# EAGLE design oresat-minusz-end-card (EAGLE 9.2.2)
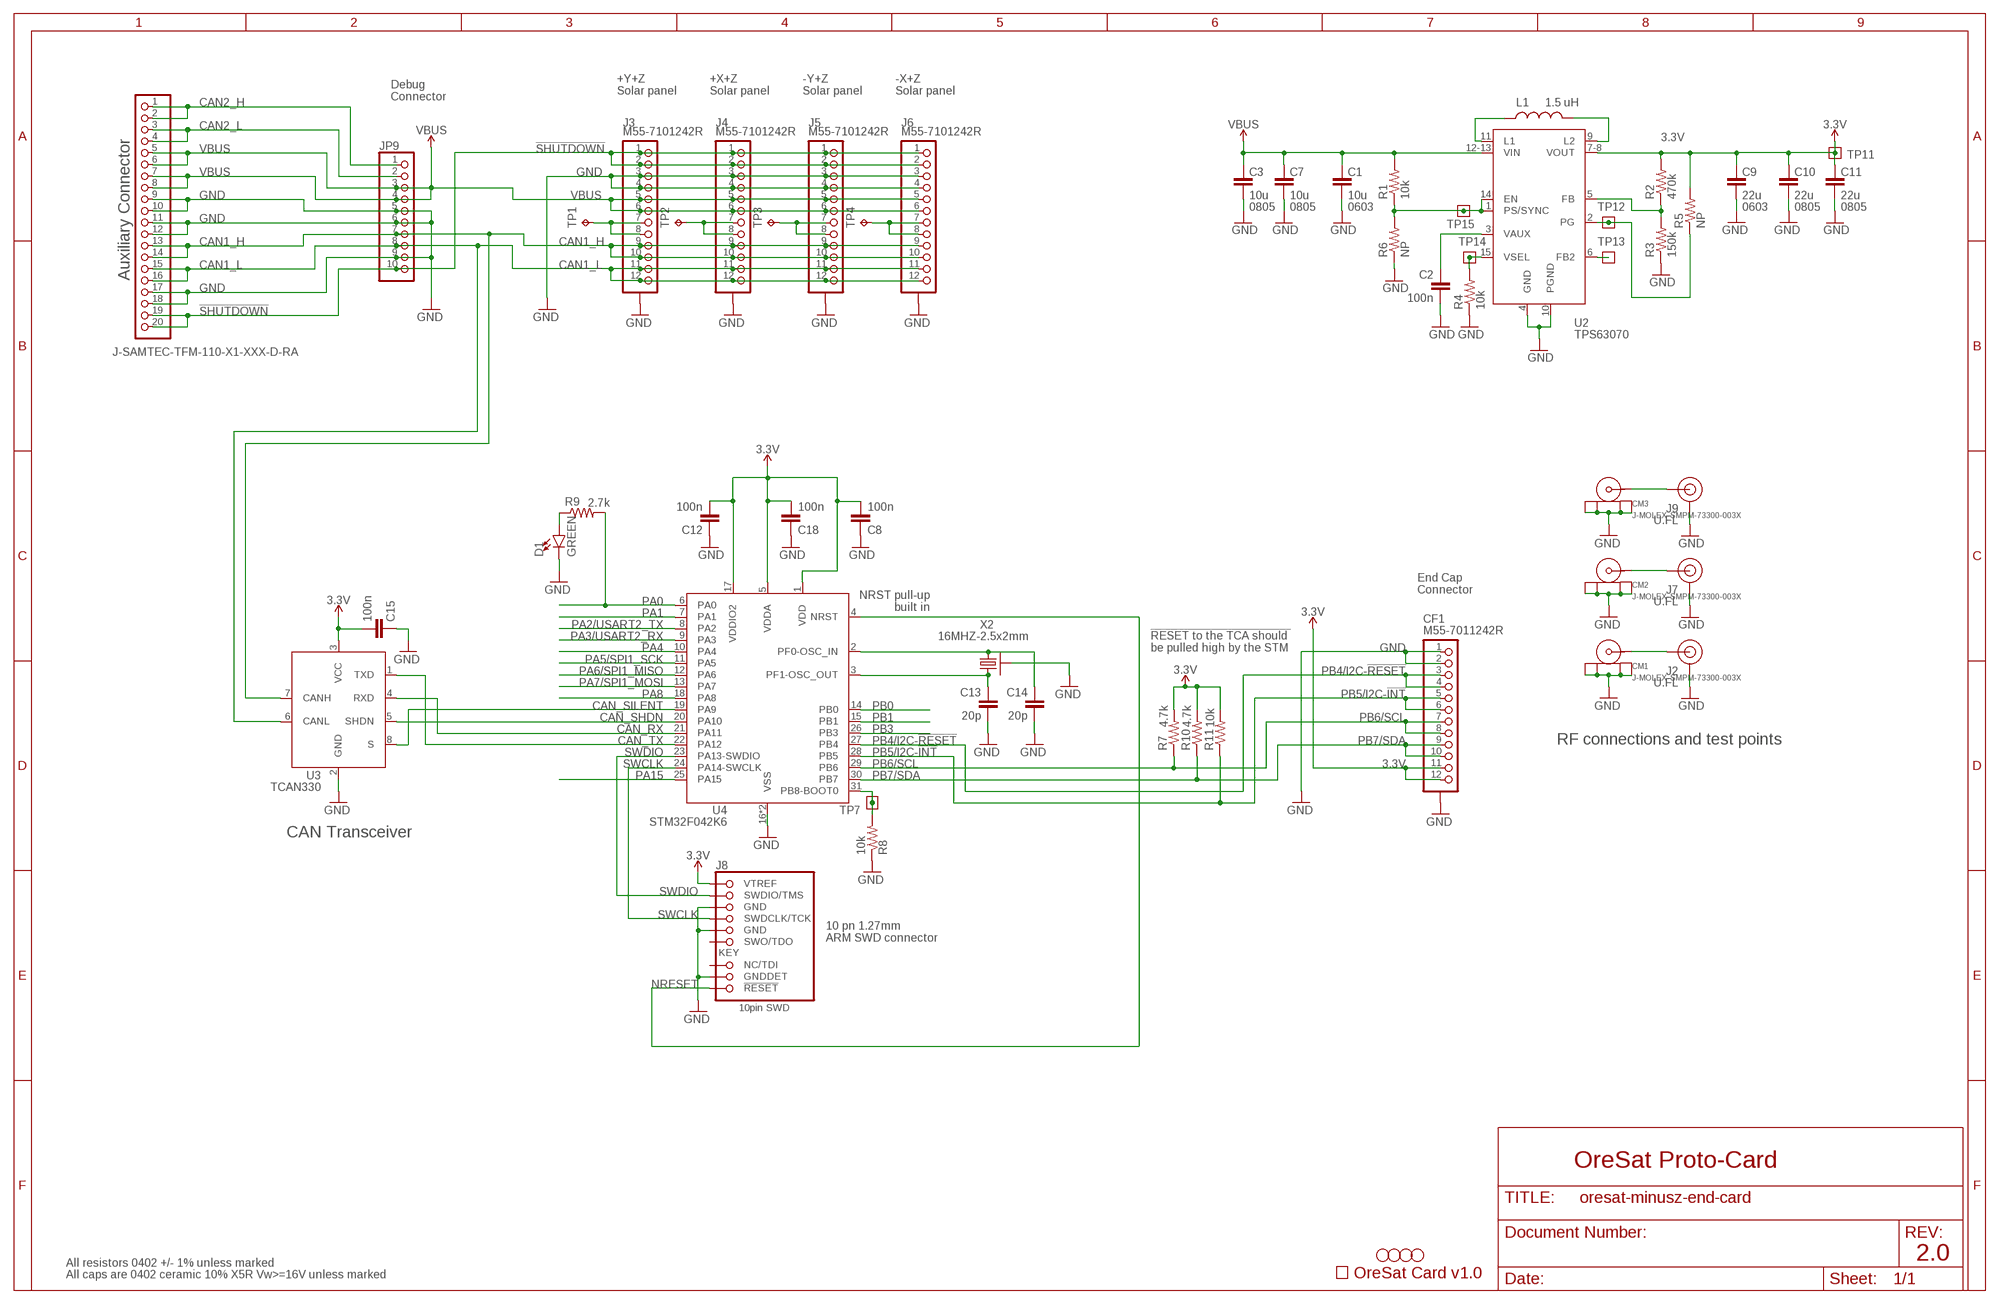
[diagram p0: schematic, sheet 1]

## Parts
C1  10u  C-EU0603-B-NOSILK  [.0603-B-NOSILK]
C2  100n  C-EU0402-B-NOSILK  [.0402-B-NOSILK]
C3  10u  C-EU0805-B-NOSILK  [.0805-B-NOSILK]
C7  10u  C-EU0805-B-NOSILK  [.0805-B-NOSILK]
C8  100n  C-EU0402-B-NOSILK  [.0402-B-NOSILK]
C9  22u  C-EU0603-B-NOSILK  [.0603-B-NOSILK]
C10  22u  C-EU0805-B-NOSILK  [.0805-B-NOSILK]
C11  22u  C-EU0805-B-NOSILK  [.0805-B-NOSILK]
C12  100n  C-EU0402-B-NOSILK  [.0402-B-NOSILK]
C13  20p  C-EU0402-B-NOSILK  [.0402-B-NOSILK]
C14  20p  C-EU0402-B-NOSILK  [.0402-B-NOSILK]
C15  100n  C-EU0402-B-NOSILK  [.0402-B-NOSILK]
C18  100n  C-EU0402-B-NOSILK  [.0402-B-NOSILK]
CARD  ORESAT-CARD-V0.5  [ORESAT-CARD-V1.0]
CF1  M55-7011242R  J-HARWIN-M55-6021242R  [HARWIN-M55-6021242R]
CM1  J-MOLEX-SMPM-73300-003X  [J-MOLEX-SMPM-073300-003X]
CM2  J-MOLEX-SMPM-73300-003X  [J-MOLEX-SMPM-073300-003X]
CM3  J-MOLEX-SMPM-73300-003X  [J-MOLEX-SMPM-073300-003X]
D1  GREEN  LED-GREEN0603  [LED-0603]
H1  STAND-OFFTIGHT  [STAND-OFF-TIGHT]
H2  STAND-OFFTIGHT  [STAND-OFF-TIGHT]
H3  STAND-OFFTIGHT  [STAND-OFF-TIGHT]
H4  STAND-OFFTIGHT  [STAND-OFF-TIGHT]
J1  J-SAMTEC-TFM-110-X1-XXX-D-RA  [J-SAMTEC-TFM-110-X1-XXX-D-RA]
J2  U.FL  U.FL2PIN  [U.FL]
J3  M55-7101242R  [M55-7101242R]
J4  M55-7101242R  [M55-7101242R]
J5  M55-7101242R  [M55-7101242R]
J6  M55-7101242R  [M55-7101242R]
J7  U.FL  U.FL2PIN  [U.FL]
J8  FTSH-105-XX-X-DV-K  [CON10_2X5_DUK_FTSH]
J9  U.FL  U.FL2PIN  [U.FL]
JP9  PINHD-1X10  [1X10]
L1  1.5 uH  L-COILCRAFT-XFL4020  [L-COILCRAFT-XFL4020]
R1  10k  R-US_0402-B-NOSILK  [.0402-B-NOSILK]
R2  470k  R-US_0402-B-NOSILK  [.0402-B-NOSILK]
R3  150k  R-US_0402-B-NOSILK  [.0402-B-NOSILK]
R4  10k  R-US_0402-B-NOSILK  [.0402-B-NOSILK]
R5  NP  R-US_0402-B-NOSILK  [.0402-B-NOSILK]
R6  NP  R-US_0402-B-NOSILK  [.0402-B-NOSILK]
R7  4.7k  R-US_0402-B-NOSILK  [.0402-B-NOSILK]
R8  10k  R-US_0402-B-NOSILK  [.0402-B-NOSILK]
R9  2.7k  R-US_0402-B-NOSILK  [.0402-B-NOSILK]
R10  4.7k  R-US_0402-B-NOSILK  [.0402-B-NOSILK]
R11  10k  R-US_0402-B-NOSILK  [.0402-B-NOSILK]
TP1  TPPAD1-13  [P1-13]
TP2  TPPAD1-13  [P1-13]
TP3  TPPAD1-13  [P1-13]
TP4  TPPAD1-13  [P1-13]
TP7  TEST-POINT  [2MM-TEST-POINT]
TP11  TEST-POINT  [2MM-TEST-POINT]
TP12  TEST-POINT  [2MM-TEST-POINT]
TP13  TEST-POINT  [2MM-TEST-POINT]
TP14  TEST-POINT  [2MM-TEST-POINT]
TP15  TEST-POINT  [2MM-TEST-POINT]
U2  TPS63070  TPS63070X  [TPS63070X]
U3  TCAN330  [SOT23-8_TI-DCN]
U4  STM32F042K6  [QFP32-7X7]
X2  16MHZ-2.5x2mm  CRYSTAL-WITH-GND  [CRYSTAL_2.5X2]

## Nets
3.3V: C8.2 C9.1 C10.1 C11.1 C12.2 C15.2 C18.2 CF1.11 CF1.12 J8.1(VTREF) R2.2 R5.2 R7.2 R10.2 R11.2 TP11.1 U2.7-8(VOUT) U3.3(VCC) U4.1(VDD) U4.5(VDDA) U4.17(VDDIO2)
!SHUTDOWN: J1.19 J1.20 J3.1 J3.2 J4.1 J4.2 J5.1 J5.2 J6.1 J6.2 JP9.10
BOOT1: R8.2 TP7.1 U4.31(PB8-BOOT0)
CAN1_H: J1.13 J1.14 J3.9 J3.10 J4.9 J4.10 J5.9 J5.10 J6.9 J6.10 JP9.7 U3.7(CANH)
CAN1_L: J1.15 J1.16 J3.11 J3.12 J4.11 J4.12 J5.11 J5.12 J6.11 J6.12 JP9.8 U3.6(CANL)
CAN2_H: J1.1 J1.2 JP9.1
CAN2_L: J1.3 J1.4 JP9.2
CAN_RX: U3.4(RXD) U4.21(PA11)
CAN_SHDN: U3.5(SHDN) U4.20(PA10)
CAN_SILENT: U3.8(S) U4.19(PA9)
CAN_TX: U3.1(TXD) U4.22(PA12)
CRYSTALIN1: C14.1 U4.2(PF0-OSC_IN) X2.1
CRYSTALOUT1: C13.1 U4.3(PF1-OSC_OUT) X2.3
GND: C1.2 C2.2 C3.2 C7.2 C8.1 C9.2 C10.2 C11.2 C12.1 C13.2 C14.2 C15.1 C18.1 CF1.1 CF1.2 CF1.P$1(SHIELDS) CF1.P$2(SHIELDS) CF1.P$3(SHIELDS) CF1.P$4(SHIELDS) CM1.P$1(SHIELD3) CM1.P$2(SHIELD2) CM1.P$3(SHIELD1) CM1.P$4(SHIELD) CM2.P$1(SHIELD3) CM2.P$2(SHIELD2) CM2.P$3(SHIELD1) CM2.P$4(SHIELD) CM3.P$1(SHIELD3) CM3.P$2(SHIELD2) CM3.P$3(SHIELD1) CM3.P$4(SHIELD) D1.C J1.9 J1.10 J1.11 J1.12 J1.17 J1.18 J2.1(GND) J2.2(GND) J3.3 J3.4 J3.P$1(SHIELD) J3.P$2(SHIELD) J3.P$3(SHIELD) J3.P$4(SHIELD) J4.3 J4.4 J4.P$1(SHIELD) J4.P$2(SHIELD) J4.P$3(SHIELD) J4.P$4(SHIELD) J5.3 J5.4 J5.P$1(SHIELD) J5.P$2(SHIELD) J5.P$3(SHIELD) J5.P$4(SHIELD) J6.3 J6.4 J6.P$1(SHIELD) J6.P$2(SHIELD) J6.P$3(SHIELD) J6.P$4(SHIELD) J7.1(GND) J7.2(GND) J8.3(GND) J8.5(GND) J8.9(GNDDET) J9.1(GND) J9.2(GND) JP9.5 JP9.6 JP9.9 R3.1 R4.1 R6.1 R8.1 U2.4(GND) U2.10(PGND) U3.2(GND) U4.16(VSS) U4.32(VSS) X2.2(SHIELD) X2.4(SHIELD)
N$1: J4.7 J4.8 TP2.TP
N$2: J3.7 J3.8 TP1.TP
N$4: J5.7 J5.8 TP3.TP
N$5: J6.7 J6.8 TP4.TP
N$7: D1.A R9.1
NRESET: J8.10(!RESET) U4.4(NRST)
PA0: R9.2 U4.6(PA0)
PA1: U4.7(PA1)
PA2/USART2_TX: U4.8(PA2)
PA3/USART2_RX: U4.9(PA3)
PA4: U4.10(PA4)
PA5/SPI1_SCK: U4.11(PA5)
PA6/SPI1_MISO: U4.12(PA6)
PA7/SPI1_MOSI: U4.13(PA7)
PA8: U4.18(PA8)
PA15: U4.25(PA15)
PB0: U4.14(PB0)
PB1: U4.15(PB1)
PB3: U4.26(PB3)
PB4/I2C-!RESET: CF1.3 CF1.4 U4.27(PB4)
PB5/I2C-!INT: CF1.5 CF1.6 R11.1 U4.28(PB5)
PB6/SCL: CF1.7 CF1.8 R7.1 U4.29(PB6)
PB7/SDA: CF1.9 CF1.10 R10.1 U4.30(PB7)
RF1: CM1.RF(CENTER) J2.FEED(SIGNAL)
RF2: CM2.RF(CENTER) J7.FEED(SIGNAL)
RF3: CM3.RF(CENTER) J9.FEED(SIGNAL)
SWCLK: J8.4(SWDCLK/TCK) U4.24(PA14-SWCLK)
SWDIO: J8.2(SWDIO/TMS) U4.23(PA13-SWDIO)
TPS-EN2: R1.1 R6.2 TP15.1 U2.1(PS/SYNC) U2.14(EN)
TPS-FB2: R2.1 R3.2 U2.5(FB)
TPS-FB4: TP13.1 U2.6(FB2)
TPS-L1: L1.1 U2.11(L1)
TPS-L2: L1.2 U2.9(L2)
TPS-PG2: R5.1 TP12.1 U2.2(PG)
TPS-VAUX2: C2.1 U2.3(VAUX)
TPS-VSEL2: R4.2 TP14.1 U2.15(VSEL)
VBUS: C1.1 C3.1 C7.1 J1.5 J1.6 J1.7 J1.8 J3.5 J3.6 J4.5 J4.6 J5.5 J5.6 J6.5 J6.6 JP9.3 JP9.4 R1.2 U2.12-13(VIN)
Unconnected: J8.6(SWO/TDO) J8.8(NC/TDI)

## Notes on the sheet
- +Y+Z
  Solar panel
- +X+Z
  Solar panel
- -Y+Z
  Solar panel
- -X+Z
  Solar panel
- Debug
  Connector
- 0805 | 0805 | 0603 | 0603 | 0805 | 0805
- Auxiliary Connector
- End Cap
  Connector
- NRST pull-up
  built in
- !RESET to the TCA should 
  be pulled high by the STM
- RF connections and test points
- CAN Transceiver
- 10 pn 1.27mm 
  ARM SWD connector
- OreSat Proto-Card
- 2.0
- All resistors 0402 +/- 1% unless marked
- All caps are 0402 ceramic 10% X5R Vw>=16V unless marked

## Library data of the parts
C1 C9 = oresat-rcl:C-EU: CAPACITOR, European symbol; DIS: Digi-Key; DPN: 1276-1001-1-ND; MFR: Samsung; MPN: CL05B104KO5NNNC
C2 C8 C12 C15 C18 = rcl_custom:C-EU: CAPACITOR, European symbol; DIS: Digi-Key; DPN: 1276-1001-1-ND; MFR: Samsung; MPN: CL05B104KO5NNNC
C3 C7 C10 C11 = oresat-rcl:C-EU: CAPACITOR, European symbol
C13 C14 = rcl_custom:C-EU: CAPACITOR, European symbol; DIS: Digi-Key; DPN: 1276-6601-1-ND; MFR: Samsung; MPN: CL05C200JB51PNC
CARD = oresat-card:ORESAT-CARD-V0.5
CF1 = J-Harwin-M55-6021242R:J-HARWIN-M55-6021242R
CM1-CM3 = J-Molex-SMPM-73300-003X:J-MOLEX-SMPM-73300-003X
D1 = SparkFun-LED:LED-GREEN: Green SMD LED Used in manufacturing of various products at SparkFun Packages: 0603 - SMD 0603 package [Product Link] <http://www.futureelectronics.com/en/technologies/semiconductors/optoelectronics/leds/Pages/9894312-LTST-C190GKT.aspx?CrossPart=HSMG-C190&IM=0> LilyPad 1206 - SMD1206 LilyPad package [Product Link] <http://www.futureelectronics.com/en/Technologies/Product.aspx?ProductID=IN150NGHARVATEKCORPORATION2049943&IM=0> 1206 - SMD1206 package [Product Link] <http://www.futureelectronics.com/en/technologies/semiconductors/optoelectronics/leds/Pages/8315665-LTST-C150KGKT.aspx?IM=0> 1206 Bottom Mount -SMD 1206 Bottom Mount [Product Link] <http://www.digikey.com/product-detail/en/lite-on-inc/LTST-C230KGKT/160-1456-1-ND/386854> SparkFun Products: Pro Mini 328 -5V <https://www.sparkfun.com/products/821> RedBoard <https://www.sparkfun.com/products/12757> MP3 Trigger <https://www.sparkfun.com/products/13720> Makey Makey <https://www.sparkfun.com/products/11076>; PROD_ID: DIO-00821
H1-H4 = SparkFun-Hardware:STAND-OFF: Stand Off Drill holes for mechanically mounting via screws, standoffs, etc. Note: Use the keepout ring to avoid running the screw head into surrounding components. Variant Overviews STAND-OFF - Mechanical footprint for a #4 phillips button head screw. STAND-OFF-TIGHT - Mechanical footprint for a #4 phillips button head screw, Example SparkFun Products Screw - Phillips Head (1/4", 4-40, 10 pack) <https://www.sparkfun.com/products/10453> (PRT-10453) Screw - Phillips Head (1/2", 4-40, 10 pack) <https://www.sparkfun.com/products/10452> (PRT-10452) Screw - Phillips Head (3/4", 4-40, 10 pack) <https://www.sparkfun.com/products/10451> (PRT-10451) Screw - Phillips Head (1", 4-40, 10 pack) <https://www.sparkfun.com/products/10450> (PRT-10450)
J1 = J-Samtec-TFM-110-X1-XXX-D-RA:J-SAMTEC-TFM-110-X1-XXX-D-RA; DIS: Digi-Key; DPN: SAM10113-ND; MFR: Samtec; MPN: TFM-110-01-L-D-RA
J2 J7 J9 = SparkFun-Connectors:U.FL2PIN: SMD Antenna Connector - U.FL 2mm height, 3.0mm x 3.0mm receptacle size. SparkFun Products: SparkFun WiFi Shield - ESP8266 <https://www.sparkfun.com/products/13287> SparkFun ESP8266 Thing <https://www.sparkfun.com/products/13231> SparkFun MiniGen - Pro Mini Signal Generator Shield <https://www.sparkfun.com/products/11420>; PROD_ID: CONN-09193; SF_ID: WRL-09144
J3-J6 = J-Harwin-M55-7101242:M55-7101242R: Harwin M55-7101242R A 12 pin 1.27 mm male SMT connector with plastic alignment pins. Note: alignment pin hole diameters are 0.05 mm smaller than recommended in order to tighten up connector location; this requires hand placement of this package.
J8 = J-Samtec-FTSH-105-XXX-DV-K-ARM-SWD:FTSH-105-XX-X-DV-K; DIS: Digi-Key; DPN: 1175-1627-ND; MFR: CNC Tech; MPN: 3220-10-0100-00
JP9 = pinhead:PINHD-1X10: PIN HEADER
L1 = L-Coilcraft-XFL4020:L-COILCRAFT-XFL4020; DIS: Mouser; DPN: 994-XFL4020-152MEB; MFR: Coilcraft; MPN: XFL4020-152ME
R1-R11 = rcl_custom:R-US_: RESISTOR, American symbol; DIS: Digi-Key; DPN: 1276-4275-1-ND; MFR: Samsung; MPN: RC1005F6653CS
TP1-TP4 = testpad:TP: Test pad
TP7 TP11-TP15 = Tova:TEST-POINT
U2 = ic-pwr-tps63070x:TPS63070X: TPS63070 2-V to 16-V Buck-Boost Converter With 3.6-A Switch Current; DIS: Digi-Key; DPN: 296-44874-1-ND; MFR: TI; MPN: TPS63070
U3 = TCAN330:TCAN330; DIS: Digi-Key; DPN: 296-44211-1-ND; MFR: Texas Instruments; MPN: TCAN330GDCNT
U4 = STM32F042K:STM32F042K6; DIS: Digi-Key; DPN: STM32F042K6T7-ND; MFR: STMicroelectronics; MPN: STM32F042K6T7
X2 = low-gain-radio:CRYSTAL-WITH-GND; DIS: Digi-Key; DPN: XC2181CT-ND; MFR: ECS Inc.; MPN: ECS-160-10-36Q-ES-TR

## Board
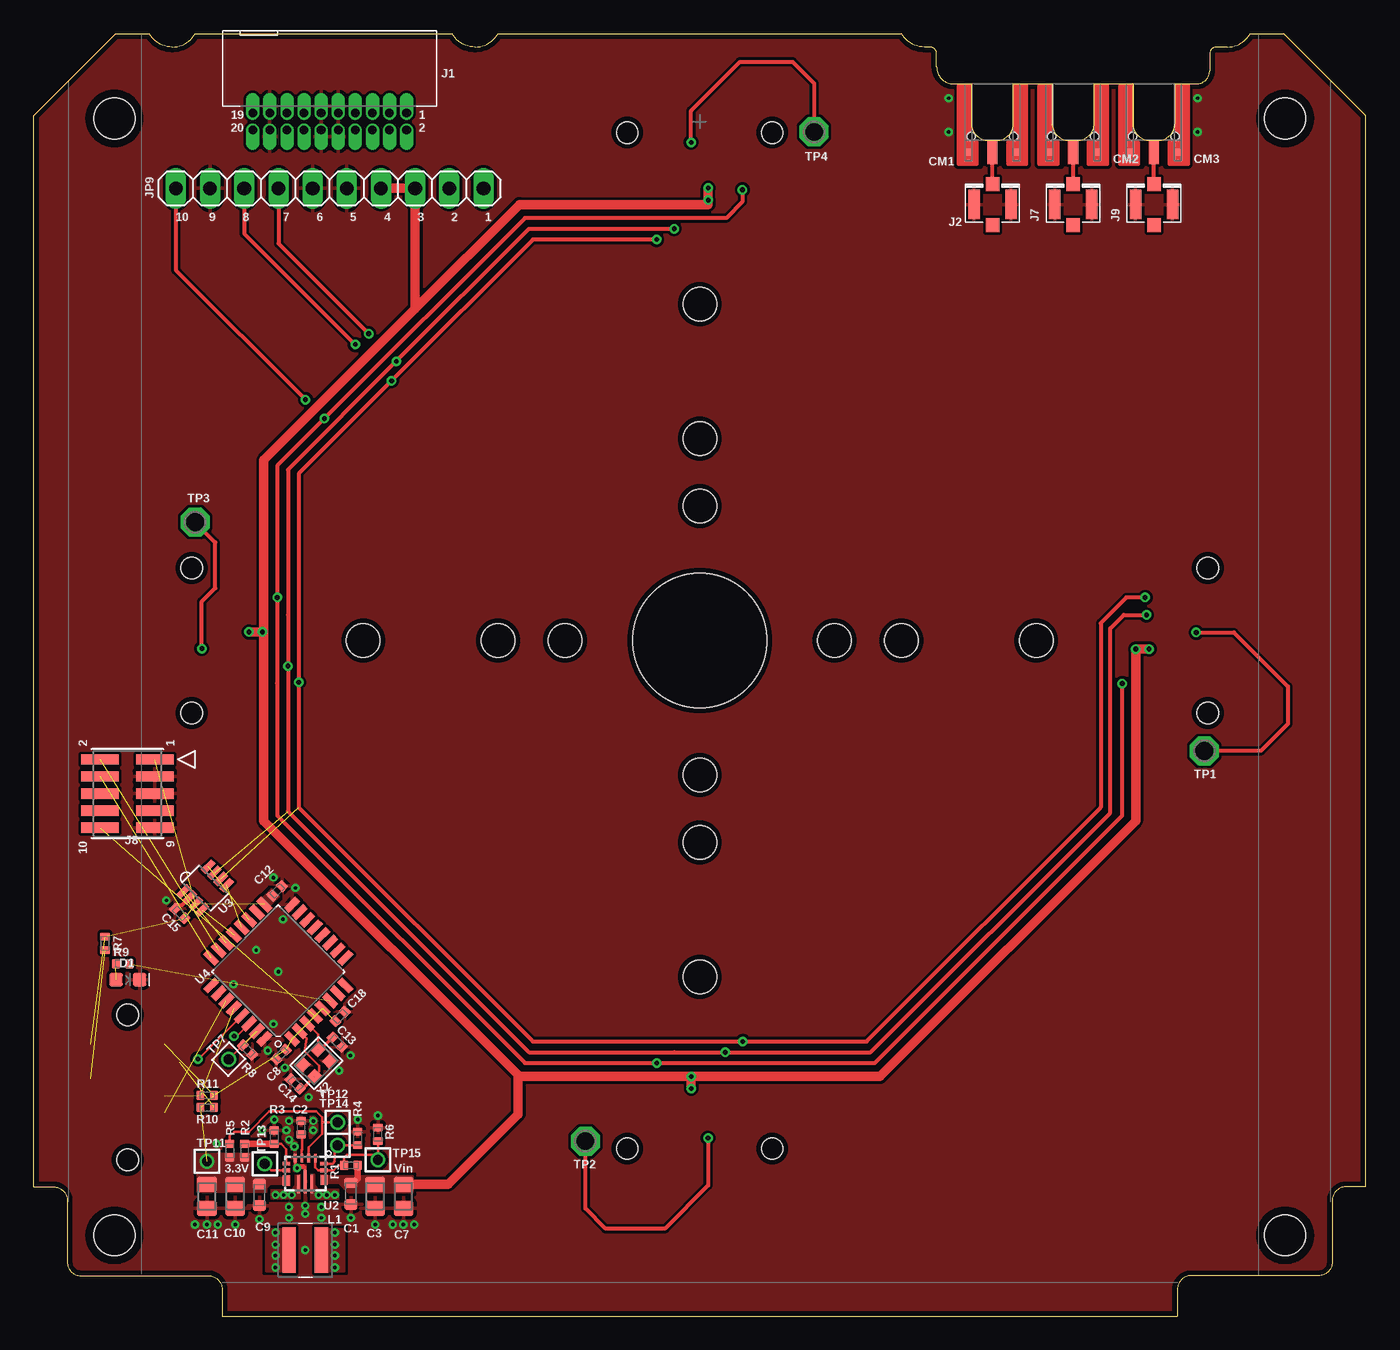
[diagram p1: board, top side]
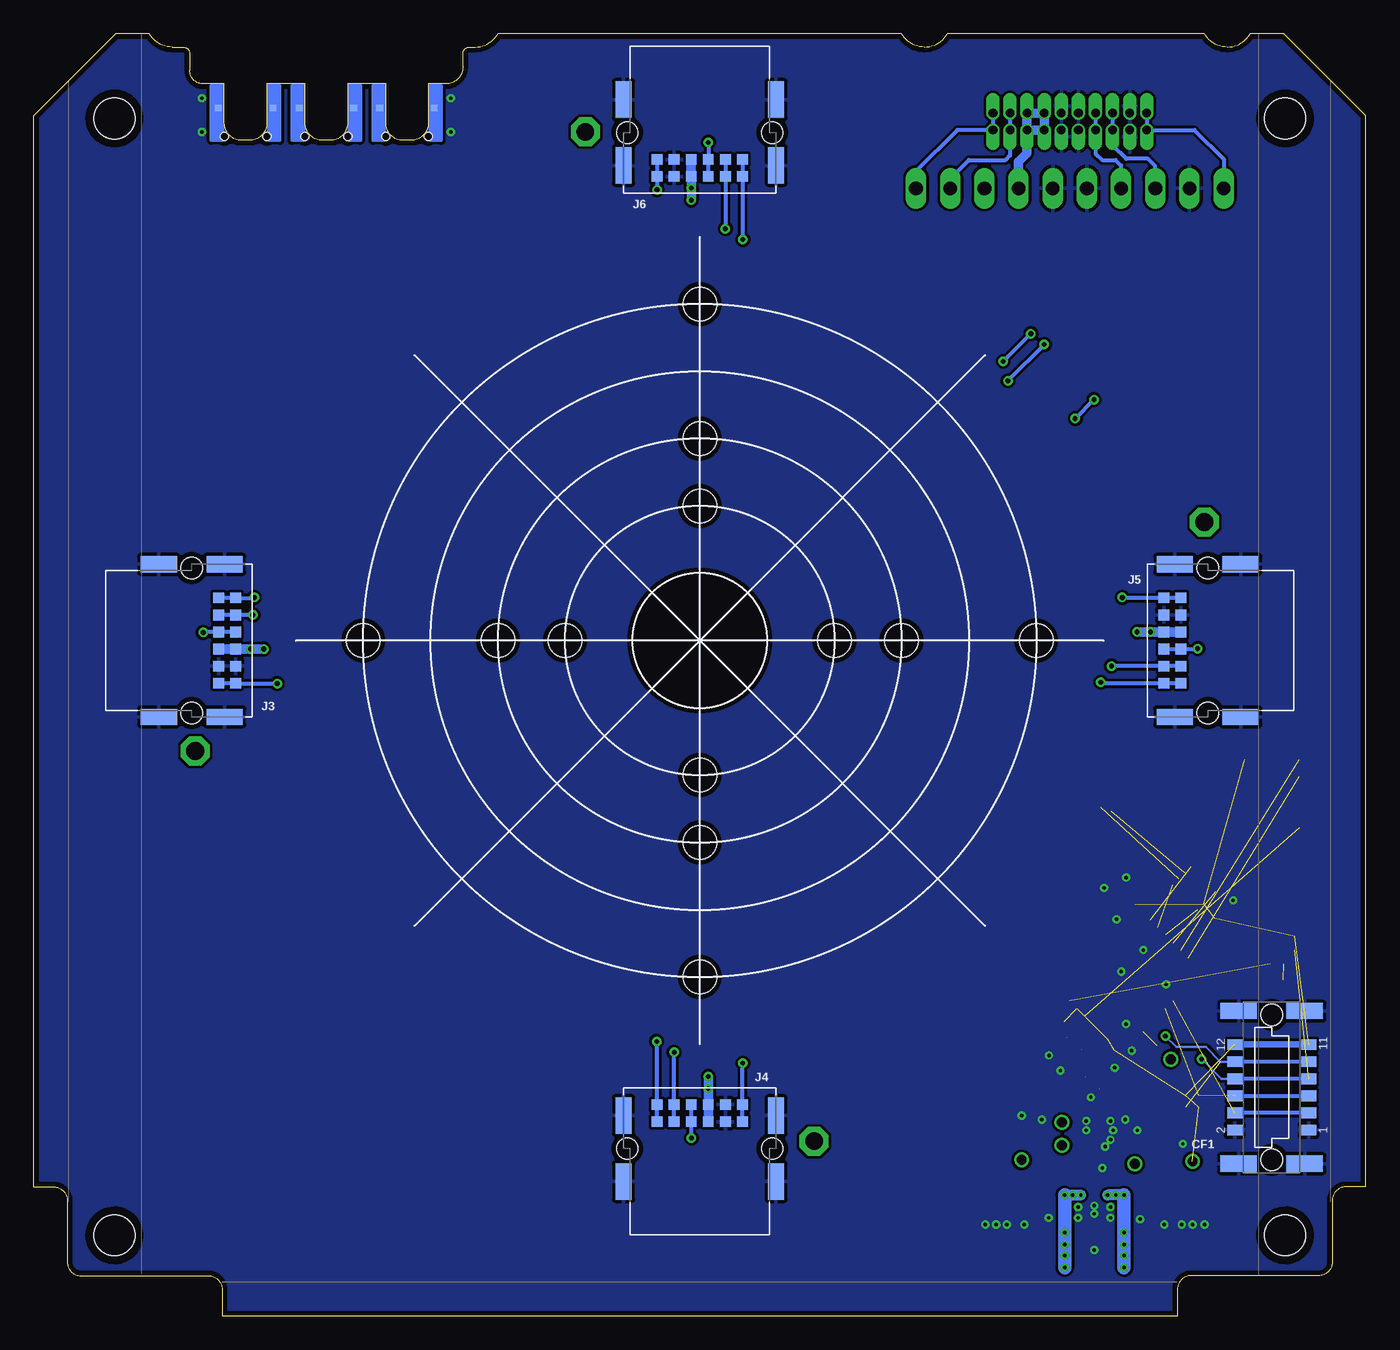
[diagram p2: board, bottom side, seen from below]

Size 99 x 95.3 mm. Coordinates in mm from the lower left corner, seen from the top.
Outline: 66.2,94.3 66.61,94.3 arc-90 67.11,93.8 67.11,92.83 arc90 68.38,91.56 69.25,91.56
Outline: 88.7,94.3 87.89,94.3 arc90 87.39,93.8 87.39,92.56 arc-90 86.4,91.56 85.25,91.56
Outline: 73.25,91.56 75.25,91.56
Outline: 79.25,91.56 81.25,91.56
Copper layers (1*16): Top 0.0356mm / dielectric 1.5011mm / Bottom 0.0356mm
Design rules "OSH-Park-2-layer *": minimum track width 6mil, minimum drill 10mil, track to track 6mil, track to pad 6mil, pad to pad 6mil, via to via 6mil, smd to smd 6mil, copper to edge 15mil, drill to drill 6mil, minimum pad ring 7mil, minimum via ring 7mil, stop-mask expansion 3mil, vias tented up to drill 13mil, thermal gap 10mil
Holes 10 mm at 49.5,50.2
Holes 2.5 mm at 49.5,60.2 59.5,50.2 49.5,40.2 39.5,50.2 74.5,50.2 49.5,25.2 49.5,75.2 24.5,50.2 34.5,50.2 49.5,65.2 64.5,50.2 49.5,35.2

### Footprints (pad centres in the part's own frame; a part is rotated, then mirrored left to right if it is on the bottom)
.0603-B-NOSILK = smd 0.8 x 0.95: 1 -0.8,0; 2 0.8,0
.0402-B-NOSILK = smd 0.6 x 0.7: 1 -0.5,0; 2 0.5,0
.0805-B-NOSILK = smd 1.15 x 1.45: 1 -0.9,0; 2 0.9,0
HARWIN-M55-6021242R = smd 0.8 x 1.1: 1 -3.175,-2.75; 2 -3.175,2.75; 3 -1.905,-2.75; 4 -1.905,2.75; 5 -0.635,-2.75; 6 -0.635,2.75; 7 0.635,-2.75; 8 0.635,2.75; 9 1.905,-2.75; 10 1.905,2.75; 11 3.175,-2.75; 12 3.175,2.75 | smd 1.2 x 2.7: P$1 -5.67,-2.45; P$2 -5.67,2.45; P$3 5.67,2.45; P$4 5.67,-2.45 | hole 1.6: -5.385,0; 5.385,0
J-MOLEX-SMPM-073300-003X = smd 0.508 x 0.508: P$1 -1.778,-5.08; P$2 1.778,-5.08 | smd 0.508 x 0.508 bottom: P$3 -2.032,-1.778; P$4 2.032,-1.778 | smd 0.762 x 1.778: RF 0,-5.08 | hole 0.61: 1.587,-3.886; -1.587,-3.886
LED-0603 = smd 1 x 1: A -0.877,0; C 0.877,0
STAND-OFF-TIGHT = hole 3.048: 0,0
J-SAMTEC-TFM-110-X1-XXX-D-RA = drill 0.635 pad 0.965 offset: 1 5.715,0.635; 2 5.715,-0.635; 3 4.445,0.635; 4 4.445,-0.635; 5 3.175,0.635; 6 3.175,-0.635; 7 1.905,0.635; 8 1.905,-0.635; 9 0.635,0.635; 10 0.635,-0.635; 11 -0.635,0.635; 12 -0.635,-0.635; 13 -1.905,0.635; 14 -1.905,-0.635; 15 -3.175,0.635; 16 -3.175,-0.635; 17 -4.445,0.635; 18 -4.445,-0.635; 19 -5.715,0.635; 20 -5.715,-0.635
U.FL = smd 2.2 x 0.85: 1 0,1.375; 2 0,-1.375 | smd 1.05 x 1: FEED 1.525,0; NC -1.525,0
M55-7101242R = smd 0.8 x 0.8: 1 3.175,2; 2 3.175,3.27; 3 1.905,2; 4 1.905,3.27; 5 0.635,2; 6 0.635,3.27; 7 -0.635,2; 8 -0.635,3.27; 9 -1.905,2; 10 -1.905,3.27; 11 -3.175,2; 12 -3.175,3.27 | smd 1.2 x 2.7: P$1 5.67,2.45; P$2 5.67,-2.45; P$3 -5.67,2.45; P$4 -5.67,-2.45 | hole 1.6: 5.385,0; -5.385,0
CON10_2X5_DUK_FTSH = smd 0.762 x 2.794: 1 2.54,-2.032; 2 2.54,2.032; 3 1.27,-2.032; 4 1.27,2.032; 5 0,-2.032; 6 0,2.032; 7 -1.27,-2.032; 8 -1.27,2.032; 9 -2.54,-2.032; 10 -2.54,2.032
1X10 = drill 1.016 long: 1 -11.43,0; 2 -8.89,0; 3 -6.35,0; 4 -3.81,0; 5 -1.27,0; 6 1.27,0; 7 3.81,0; 8 6.35,0; 9 8.89,0; 10 11.43,0
L-COILCRAFT-XFL4020 = smd 0.98 x 3.4: 1 -1.2,0; 2 1.2,0
P1-13 = drill 1.321 pad 2.159 octagon: TP 0,0
2MM-TEST-POINT = drill 0.737: 1 0,0
TPS63070X = smd 0.6 x 0.25: 1 -1.15,0.75; 2 -1.15,0.25; 3 -1.15,-0.25; 4 -1.15,-0.75 | smd 0.25 x 0.6: 5 -0.725,-1.4; 6 -0.225,-1.4; 14 -0.225,1.4; 15 -0.725,1.4 | smd 0.75 x 0.6: 7-8 0.525,-1.4; 12-13 0.475,1.4 | smd 1.35 x 0.25: 9 0.775,-0.5; 11 0.775,0.5 | smd 1.7 x 0.25: 10 0.6,0
SOT23-8_TI-DCN = smd 0.45 x 1.1: 1 -0.975,-1.3; 2 -0.325,-1.3; 3 0.325,-1.3; 4 0.975,-1.3; 5 0.975,1.3; 6 0.325,1.3; 7 -0.325,1.3; 8 -0.975,1.3
QFP32-7X7 = smd 1.2 x 0.5: 1 -4.25,2.8; 2 -4.25,2; 3 -4.25,1.2; 4 -4.25,0.4; 5 -4.25,-0.4; 6 -4.25,-1.2; 7 -4.25,-2; 8 -4.25,-2.8; 17 4.25,-2.8; 18 4.25,-2; 19 4.25,-1.2; 20 4.25,-0.4; 21 4.25,0.4; 22 4.25,1.2; 23 4.25,2; 24 4.25,2.8 | smd 0.5 x 1.2: 9 -2.8,-4.25; 10 -2,-4.25; 11 -1.2,-4.25; 12 -0.4,-4.25; 13 0.4,-4.25; 14 1.2,-4.25; 15 2,-4.25; 16 2.8,-4.25; 25 2.8,4.25; 26 2,4.25; 27 1.2,4.25; 28 0.4,4.25; 29 -0.4,4.25; 30 -1.2,4.25; 31 -2,4.25; 32 -2.8,4.25
CRYSTAL_2.5X2 = smd 0.9 x 0.8: 1 -0.825,-0.625; 2 0.825,-0.625; 3 0.825,0.625; 4 -0.825,0.625

### Placement (x,y rotation side)
C1  23.58,9.1 270 top
C2  19.88,14 90 top
C3  25.38,8.9 270 top
C7  27.48,8.9 270 top
C8  18.39,19.44 45 top
C9  16.78,9 270 top
C10  14.98,8.9 270 top
C11  12.88,8.9 270 top
C12  18.11,31.6 225 top
C13  22.56,20.36 315 top
C14  19.45,17.25 135 top
C15  10.86,29.91 315 top
C18  22.77,22.27 225 top
CARD  0,0 0 top
CF1  7,17 90 bottom
CM1  71.25,91.56 0 top
CM2  77.25,91.56 0 top
CM3  83.25,91.56 0 top
D1  7,25 0 top
H1  93,6 0 top
H2  93,89 0 top
H3  6,89 0 top
H4  6,6 0 top
J1  22,88.77 0 top
J2  71.25,82.6 90 top
J3  87.25,50.2 270 bottom
J4  49.5,12.45 0 bottom
J5  11.75,50.2 90 bottom
J6  49.5,87.95 180 bottom
J7  77.25,82.6 90 top
J8  6.97,38.83 90 top
J9  83.25,82.6 90 top
JP9  22,83.8 180 top
L1  20.18,4.9 180 top
R1  23.58,11.2 0 top
R2  15.68,12.3 270 top
R3  17.88,13.3 270 top
R4  24.08,13.2 270 top
R5  14.58,12.3 270 top
R6  25.58,13.5 270 top
R7  5.3,27.7 90 top
R8  15.9,19.78 135 top
R9  6.61,26.19 0 top
R10  12.9,15.5 180 top
R11  12.9,16.4 0 top
TP1  87,42 0 top
TP2  41,13 0 top
TP3  12,59 0 top
TP4  58,88 0 top
TP7  14.5,19.09 315 top
TP11  12.88,11.5 270 top
TP12  22.58,14.4 270 top
TP13  17.18,11.3 270 top
TP14  22.58,12.7 270 top
TP15  25.58,11.6 270 top
U2  20.18,10.6 270 top
U3  12.74,31.79 315 top
U4  18.18,25.59 135 top
X2  21,18.8 45 top

### Tracks (layer width: path | path; a pad name or v marks a point on that pad's centre or on a via)
3.3V  (12 unrouted)
  Bottom 0.5: CF1.11 CF1.12
  pour Top (rank 2, no thermals): 18.98,9.8 17.58,9.8 17.28,9.5 17.28,9.2 12.19,9.2 12.15,12.1 16.18,12.1 16.18,10.3 18.98,10.3
  pour Top (no thermals): 16.76,30.82 17.33,30.26 18.25,31.18 17.68,31.74
!SHUTDOWN  (via drill 0.35)
  Top 0.3: 18.1,47 v18.1,53.4 18.1,63.2 v21.6,66.7 36.5,81.6 51.48,81.6 52.67,82.8 v52.67,83.7 | 18.1,47 18.1,37.2 36.5,18.8 v46.3,18.8 62.5,18.8 80.9,37.2 v80.9,47 | JP9.10 10.57,77.73 v20.2,68.1 | 18.07,47.02 18.1,47
  Bottom 0.3: J6.1 J6.2 v52.67,83.7 | J3.1 J3.2 83.95,47 v80.9,47 | J4.1 J4.2 46.33,18.77 v46.3,18.8 | J5.1 J5.2 18.07,53.38 v18.1,53.4 | J1.19 J1.20 12.73,88.13 10.57,85.97 JP9.10 | v21.6,66.7 v20.2,68.1
BOOT1  (1 unrouted)
  Top 0.2: TP7.1 U4.31
CAN1_H  (via drill 0.35)  (2 unrouted)
  Top 0.2: U3.7 13.46,32.94
  Top 0.3: JP9.7 18.19,79.71 v24.9,73 | 18.9,52.1 18.9,62.9 v26.95,70.95 36.8,80.8 v47.6,80.8 | 18.89,52.1 18.9,52.1 | 18.9,52.1 v18.9,48.3 18.9,37.5 36.8,19.6 47.6,19.6 | 47.59,19.59 47.6,19.6 | 47.6,19.6 v51.4,19.6 62.2,19.6 80,37.4 80,51.1 81,52.1 v82.7,52.1
  Bottom 0.3: J1.13 J1.14 20.09,86.39 19.6,85.9 18.6,85.9 18.19,85.49 JP9.7 | J5.9 J5.10 v18.89,48.3 v18.9,48.3 | J6.9 J6.10 v47.6,80.8 | J4.9 J4.10 v51.41,19.59 v51.4,19.6 | J3.9 J3.10 v82.7,52.1 | v24.9,73 v26.95,70.95
CAN1_L  (via drill 0.35)  (1 unrouted)
  Top 0.3: v46.3,80 37.1,80 v26.6,69.5 19.7,62.6 v19.7,47.1 19.7,37.8 37.1,20.4 v52.7,20.4 61.9,20.4 79.3,37.8 79.3,51.5 81.2,53.4 v82.6,53.4 | JP9.8 15.65,80.45 v23.9,72.2
  Bottom 0.3: J1.15 J1.16 18.82,87.03 17.8,86 16.2,86 15.65,85.45 JP9.8 | J5.11 J5.12 19.62,47.02 v19.7,47.1 | J6.11 J6.12 46.33,80.03 v46.3,80 | J4.11 J4.12 52.67,20.38 v52.7,20.4 | J3.11 J3.12 82.62,53.38 v82.6,53.4 | v23.9,72.2 v26.6,69.5
CAN2_H
  Bottom 0.3: J1.1 J1.2 30.37,88.13 33.43,85.07 JP9.1
CAN2_L
  Bottom 0.3: J1.3 J1.4 26.45,86.25 26.8,85.9 29.5,85.9 30.89,84.51 JP9.2
CAN_RX  (1 unrouted)
CAN_SHDN  (1 unrouted)
CAN_SILENT  (1 unrouted)
CAN_TX  (1 unrouted)
CRYSTALIN1  (3 unrouted)
  Top 0.2: 20.86,17.81 21.22,18.17 21.22,18.59 20.16,19.65 20.3,20.64 U4.2
  Top 0.25: C14.1 19.98,16.89 X2.1 20.86,17.81
CRYSTALOUT1  (2 unrouted)
  Top 0.2: U4.3 21.15,20.92 X2.3
  Top 0.25: C13.1 21.32,19.83 X2.3
GND  (via drill 0.25)
  Top 0.2: U2.10 20.18,11.1 | 20.18,11.1 20.08,11 v19.58,11 19.43,11.15 U2.4 | 19.48,11.2 19.71,11.2 20.08,11.2 20.18,11.1
  Top 0.3: U3.2 11.01,30.52 10.76,30.52 C15.1
  other vias: 86.5,90.5 86.5,88 68,88 68,90.5 19.38,12.6 18.98,13.1 14.98,6.8 12.88,6.8 13.68,6.8 11.98,6.8 16.78,7.2 18.98,8.1 18.98,7.3 21.38,7.3 21.38,8.1 20.18,8.2 20.18,7.6 20.18,4.9 18.98,14.5 18.78,13.8 16.98,13.8 17.88,14.6 23.58,7.3 25.38,6.8 27.48,6.8 26.68,6.8 28.28,6.8 20.78,14.5 20.78,13.8 24.08,14.6 25.58,14.9 13.6,12.8 18.18,25.59 9.86,30.89 17.82,32.59 19.45,31.81 23.55,19.37 22.7,18.24 18.67,18.45 17.4,19.72 17.82,21.7 18.53,29.48 16.54,27.2 14.84,24.66 20.44,16.26
  pour Top (isolate 0.2, rank 6): 0,0 99,0 99,95.3 0,95.3
  pour Bottom (isolate 0.2, rank 6): 0,0 99,0 99,95.3 0,95.3
N$1  (via drill 0.35)
  Top 0.3: v50.12,13.22 50.12,9.71 46.9,6.5 42.5,6.5 41,8 TP2.TP
  Bottom 0.3: J4.8 J4.7 50.13,13.23 v50.12,13.21 | 50.1,13.2 v50.12,13.21 | v50.12,13.21 v50.12,13.22
N$2  (via drill 0.35)
  Top 0.3: TP1.TP 91.2,42 93.2,44 93.2,46.8 89.2,50.8 v86.4,50.8
  Bottom 0.3: J3.8 J3.7 86.36,50.84 v86.4,50.8
N$4  (via drill 0.35)
  Top 0.3: v12.5,49.6 12.5,53.1 13.5,54.1 13.5,57.5 TP3.TP
  Bottom 0.3: J5.8 J5.7 12.54,49.56 v12.5,49.6
N$5  (via drill 0.35)
  Top 0.3: v48.86,87.22 48.86,89.56 52.5,93.2 56.4,93.2 58,91.6 TP4.TP
  Bottom 0.3: J6.8 J6.7 v48.87,87.22 v48.86,87.22
N$7  (1 unrouted)
NRESET  (1 unrouted)
PA0  (1 unrouted)
PB4/I2C-!RESET  (1 unrouted)
  Bottom 0.3: CF1.3 CF1.4
PB5/I2C-!INT  (2 unrouted)
  Bottom 0.3: CF1.6 CF1.5
PB6/SCL  (via drill 0.35)  (1 unrouted)
  Top 0.2: U4.29 12.25,19.1 v12.2,19.1
  Bottom 0.2: CF1.8 10.73,17.64 v12.2,19.1
  Bottom 0.3: CF1.7 CF1.8
PB7/SDA  (via drill 0.35)  (1 unrouted)
  Top 0.2: U4.30 15.08,20.8 v14.9,20.8
  Bottom 0.2: v14.9,20.8 14.1,20 11.9,20 10.8,18.91 CF1.10
  Bottom 0.3: CF1.9 CF1.10
RF1
  Top 0.3: J2.FEED CM1.RF
RF2
  Top 0.3: J7.FEED CM2.RF
RF3
  Top 0.3: J9.FEED CM3.RF
SWCLK  (1 unrouted)
SWDIO  (1 unrouted)
TPS-EN2
  Top 0.2: U2.1 20.93,11.05 21.16,10.82 U2.14 22.3,10.82 22.68,11.2 R1.1 23.08,11.8 23.28,12 25.18,12 TP15.1 R6.2
TPS-FB2
  Top 0.2: U2.5 18.78,12.4 18.38,12.8 R3.2
  Top 0.5: R3.2 R2.1
TPS-FB4
  Top 0.2: U2.6 17.66,10.82 TP13.1
TPS-L1  (via drill 0.25)
  Bottom 0.8: v22.38,9 v21.18,9
  Bottom 1: v22.38,9 v22.38,3.6
  other vias: 21.78,9 22.38,6.2 22.38,5.3 22.38,4.5
  pour Top (no thermals): 20.58,10.5 20.58,8.7 22.68,8.7 22.68,9.4 21.18,9.4 20.88,9.7 20.88,10.5
  pour Top (no thermals): 20.98,3.3 20.98,6.5 23.08,6.5 23.08,3.3
TPS-L2  (via drill 0.25)
  Bottom 0.8: v17.98,9 v19.18,9
  Bottom 1: v17.98,9 v17.98,6.2 v17.98,3.6
  other vias: 18.58,9 17.98,4.5 17.98,5.3
  pour Top (no thermals): 19.78,10.5 19.78,8.7 17.68,8.7 17.68,9.4 19.18,9.4 19.48,9.7 19.48,10.5
  pour Top (no thermals): 19.38,6.5 19.38,3.3 17.28,3.3 17.28,6.5
TPS-PG2
  Top 0.2: U2.2 20.43,12.55 21.43,13.55 21.43,14.4 | 21.43,14.4 21.43,14.75 20.98,15.2 17.5,15.2 16,13.7 14.9,13.7 14.58,13.38 R5.1 | TP12.1 21.43,14.4
TPS-VAUX2
  Top 0.2: U2.3 19.93,12.36 19.94,12.37 19.94,13.44 C2.1
TPS-VSEL2
  Top 0.2: U2.15 22.2,11.32 22.38,11.5 22.38,12.4 TP14.1 R4.2
VBUS  (via drill 0.35)
  Top 0.2: 27.55,9.87 C7.1
  Top 0.5: R1.2 24.08,10.2 23.78,9.9 C1.1
  Top 0.7: 28.35,74.85 36.1,82.6 50.13,82.6 v50.13,83.83 | 28.35,74.85 17.1,63.6 17.1,50.84 | 17.1,50.84 17.1,36.8 36.1,17.8 | 36.1,17.8 36,17.8 36,15 30.8,9.8 C7.1 | 36.1,17.8 v48.87,17.8 | v48.87,17.8 62.9,17.8 81.9,36.8 v81.9,49.56 v82.9,49.56 | 28.35,74.85 JP9.3 JP9.4 | v16,50.84 17.1,50.84 | v48.87,17.8 v48.87,16.9
  Bottom 0.7: J3.5 J3.6 v82.9,49.56 81.93,49.56 | J4.5 J4.6 v48.87,16.9 v48.87,17.8 | J6.5 J6.6 v50.13,83.83 v50.13,82.93 | J5.5 J5.6 v16,50.84 v17,50.84 | JP9.4 25.81,85.79 25.2,86.4 25.2,88.11 J1.6 | J1.6 J1.5 J1.7 J1.8 J1.6
  pour Top (rank 2, no thermals): 21.38,9.9 22.68,9.9 23.38,9.2 28.18,9.2 28.18,10.4 21.38,10.4

### Text on the board
tPlace: 10 | 9 | 8 | 7 | 6 | 5 | 4 | 3 | 2 | 1 | OreSat -Z End Card v1.0 | 2018/12/21 | 3.3V | Vin